# EasyEDA Pro project New Project_2022-11-25_16-02-02.eprj

# Schematic Schematic1
Create Date: 2022-11-25; Page Name: P1; Project Name: New Project_2022-11-25_16-02-02; Schematic Name: Schematic1; Update Date: 2022-11-25; Company: EasyEDA.com; Drawed: EasyEDA Pro; Page Size: A4; Part Number: JLCPCB-002; Reviewed: EasyEDA Pro; Version: V0.1
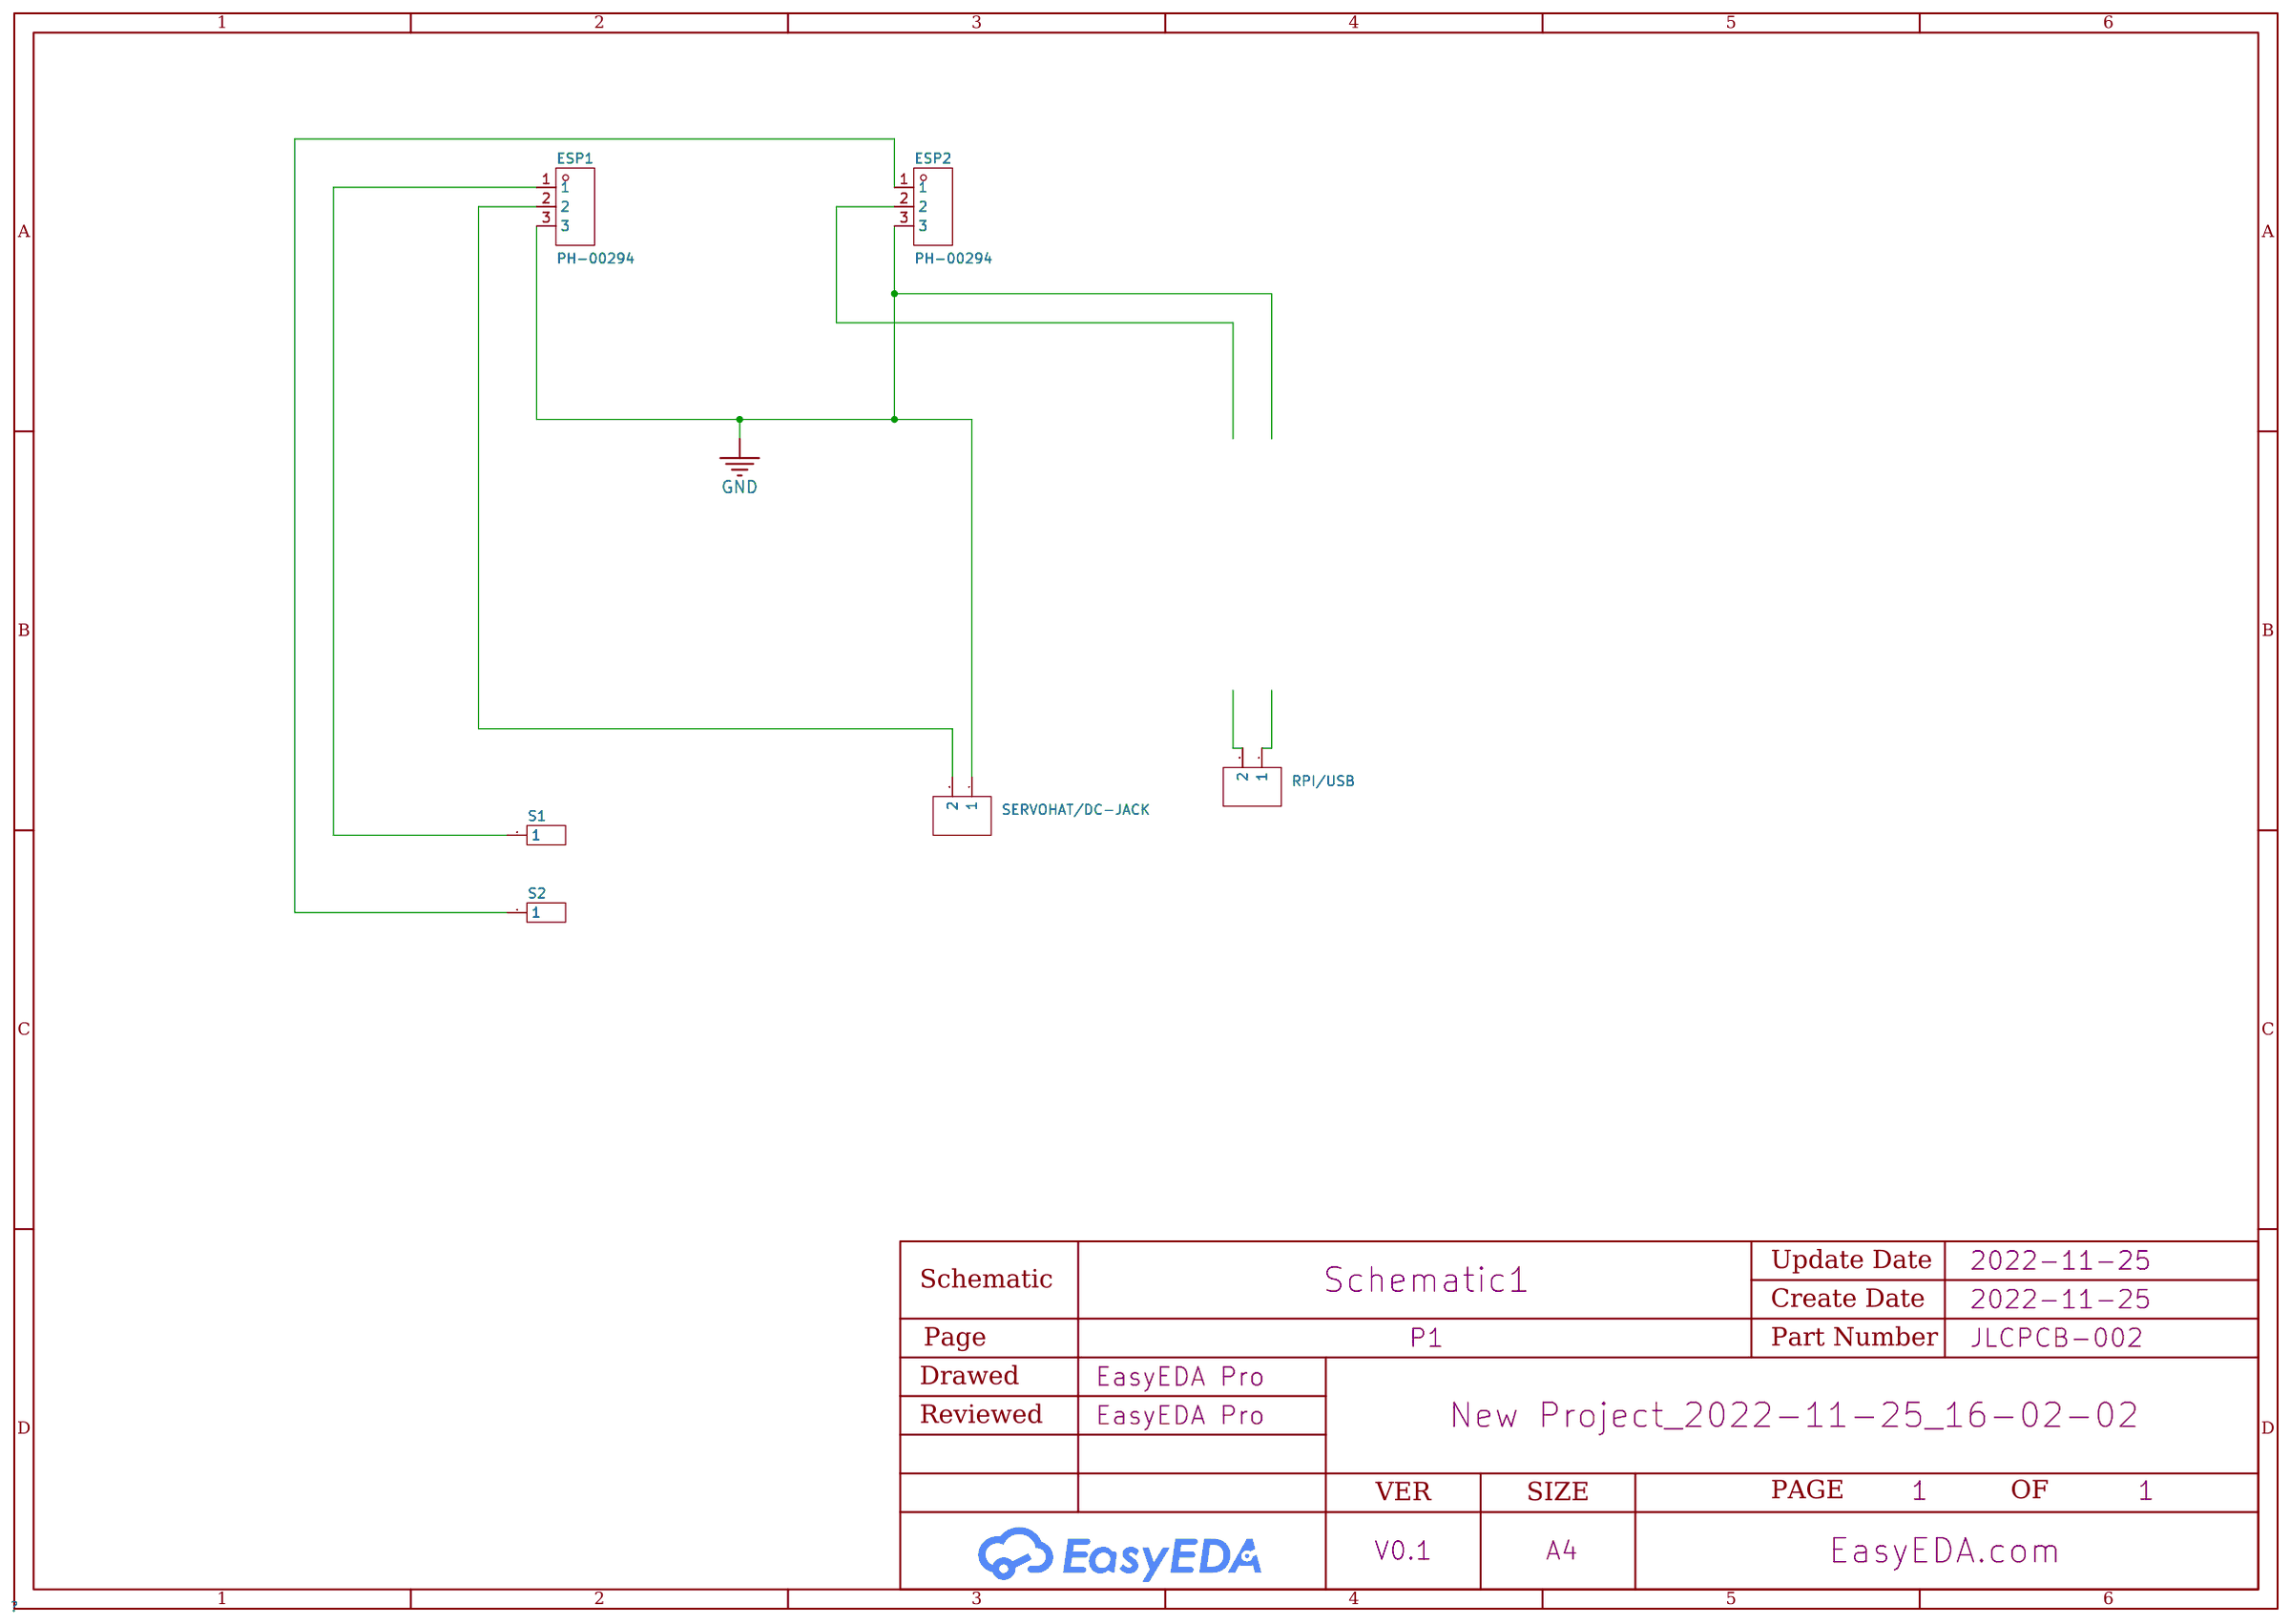
[diagram p0: schematic sheet]

## Parts
?#1  -
ESP1  PH-00294  [HDR-TH_3P-P2.54-V-M-B]
ESP2  PH-00294  [HDR-TH_3P-P2.54-V-M-B]
RPI/USB  -  [HDR-TH_2P-P2.54-V-F]
S1  -  [HDR-TH_1P-V-M_XKB_X4611WV-01I-C28D40]
S2  -  [HDR-TH_1P-V-M_XKB_X4611WV-01I-C28D40]
SERVOHAT/DC-JACK  -  [HDR-TH_2P-P2.54-V-F]

## Library data of the parts
ESP1 ESP2 = PH-00294: Pitch:2.54mm Number of Pins:3 Number of Rows: Pin Structure:1x3P Row Spacing:- Mounting Type:Straight Circluar Pins/Square Pins:Square Pins Current Rating (Max):3A Voltage Rating (Max):- Length of Mating Pin:3mm Insulation Height:- Length of End Connectio; LCSC Part Name: 2.54mm 1x3P 直插 方针; Supplier Part: C2829878; Manufacturer: Liansheng(连盛); Supplier Footprint: 直插,P=2.54mm; JLCPCB Part Class: Extended Part; Datasheet: https://atta.szlcsc.com/upload/public/pdf/source/20210507/C2829878_DC481C04FB41A0FEE0C13D51409916DB.pdf; Supplier: LCSC; Pitch: 2.54mm; Number of Pins: 3; Pin Structure: 1x3P; Mounting Type: Straight; Circluar Pins/Square Pins: Square Pins; Current Rating (Max): 3A; Length of Mating Pin: 3mm; Length of End Connection Pin: 3mm; Operating Temperature Range: -40~+105; Color: Black
RPI/USB SERVOHAT/DC-JACK = HDR-F_2.54_1x2P: Supplier Footprint: Through
S1 S2 = HDR-M_2.54_1x1P: Supplier Footprint: Through

## Nets
GND: ?#1.2 ESP1.3 ESP2.3 SERVOHAT/DC-JACK.1
Net-(?#1-1): ?#1.1 ESP2.2
Net-(?#1-3): ?#1.3 RPI/USB.2
Net-(?#1-4): ?#1.4 RPI/USB.1
Net-(ESP1-1): ESP1.1 S1.1
Net-(ESP1-2): ESP1.2 SERVOHAT/DC-JACK.2
Net-(ESP2-1): ESP2.1 S2.1

# Schematic XH-M401_8A
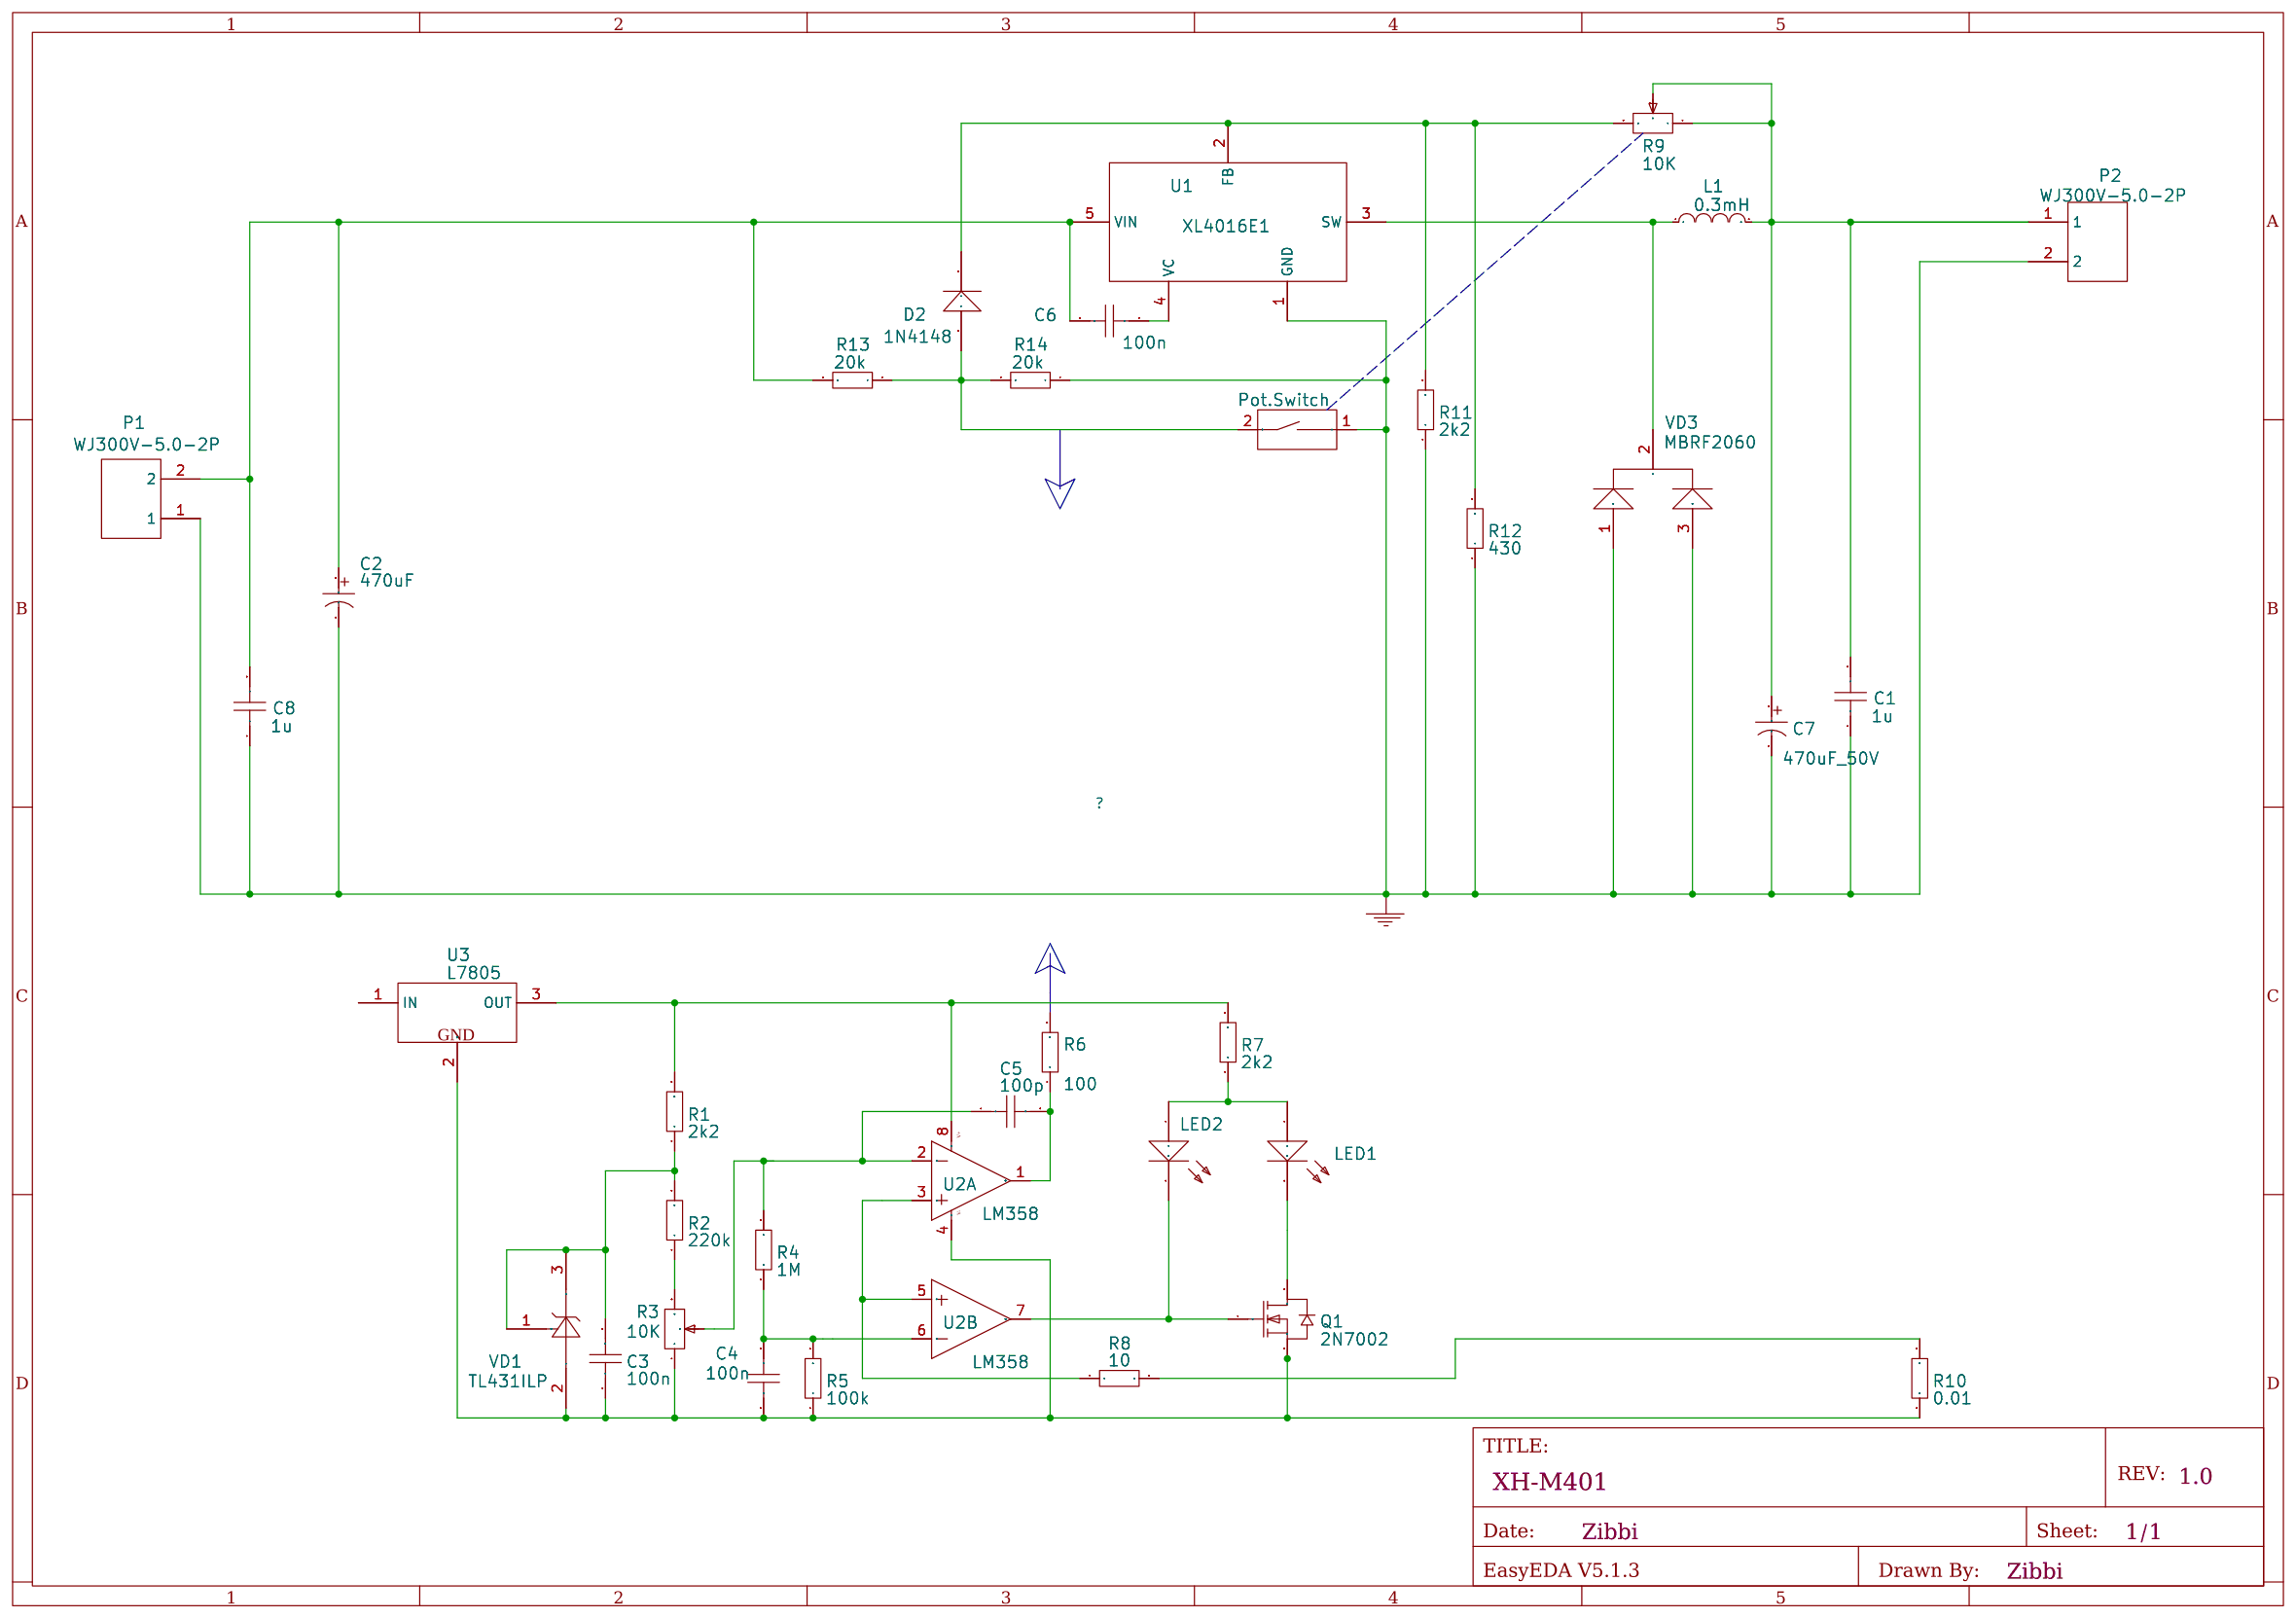
[diagram p1: schematic sheet]

## Parts
C1  1u
C2  470uF
C3  100n
C4  100n
C5  100p
C6  100n
C7  1000uF
C8  1u
D2  1N4148
L1  0.3mH
LED1  204-10UYC/S530-A3
LED2  204-10UYC/S530-A3
P1  WJ300V-5.0-2P
P2  WJ300V-5.0-2P
POT  Pot.Switch
Q1  2N7002
R1  2k2
R2  220k
R3  10KΩ
R4  1M
R5  100k
R6  100
R7  2k2
R8  10
R9  10KΩ
R10  0.18Ω
R11  2k2
R12  430
R13  20k
R14  20k
U1  XL4016E1
U2  LM358  (sections 1,2)
U3  L7805
VD1  TL431ILP
VD3  MBRF2060

## Library data of the parts
C1 C3-C6 C8 L1 R1 R2 R4-R8 R11-R14 U2 = ?
C2 = KF471M050G200A: Voltage: 50V; Supplier: LCSC; Manufacturer: CapXon; Supplier Part: C59355
C7 = KF102M050I250A: Voltage: 50V; Supplier: LCSC; Manufacturer: CapXon; Supplier Part: C59328
D2 = 1N4148: Supplier: LCSC; Manufacturer: ST; Supplier Part: C14516
LED1 LED2 = 204-10UYC/S530-A3: Supplier: LCSC; Manufacturer: EVERLIGHT; Supplier Part: C73643
P1 P2 = WJ300V-5.0-2P: Supplier: LCSC; Manufacturer: ReliaPro; image: //image.lceda.cn/szlcsc/C8385.jpg; Supplier Part: C8385
POT = VDG/S-01L blue: Supplier: LCSC; Manufacturer: ReliaPro; image: //image.lceda.cn/szlcsc/C47086.jpg; Supplier Part: C47086
Q1 = 2N7002: Supplier: LCSC; Manufacturer: CJ; Supplier Part: C8545
R3 R9 = 3362S-1-103LF: Supplier: LCSC; Manufacturer: BOURNS; Supplier Part: C81272
R10 = 25121WF180LT4F: Power: 1W; Tolerance: ±1%; Supplier: LCSC; Manufacturer: UniOhm; Supplier Part: C48628
U1 = XL4016E1: Supplier: LCSC; Manufacturer: XLSEMI; Supplier Part: C55881
U3 = L7805ABV: Supplier: LCSC; Manufacturer: STMicroelectronics; Supplier Part: C16807
VD1 = TL431ILP: Supplier: LCSC; Manufacturer: TI; Supplier Part: C113522
VD3 = ?: SWITCHMODE(TM) Schottky Power Rectifier, 3-Pin TO-220FP, Tube

## Nets
GND: C1.1 C2.2 C7.2 C8.1 P1.1 P2.2 POT.1 R11.1 R12.1 R14.1 U1.1(GND) VD3.1(A1) VD3.3(A2)
Net-(C1-2): C1.2 C7.1 L1.2 P2.1 R9.1 R9.2
Net-(C2-1): C2.1 C6.2 C8.2 P1.2 R13.2 U1.5(VIN)
Net-(C3-1): C3.1 C4.1 Q1.2(S) R3.1 R5.1 R10.1 U2.4(V-) U3.2(GND) VD1.2(A)
Net-(C3-2): C3.2 R1.1 R2.2 VD1.1(REF) VD1.3(C)
Net-(C4-2): C4.2 R4.1 R5.2 U2.6(-IN)
Net-(C5-1): C5.1 R3.2 R4.2 U2.2(-IN)
Net-(C5-2): C5.2 R6.1 U2.1(OUT)
Net-(C6-1): C6.1 U1.4(VC)
Net-(D2-1): D2.1(A) POT.2 R13.1 R14.2
Net-(D2-2): D2.2(K) R9.3 R11.2 R12.2 U1.2(FB)
Net-(L1-1): L1.1 U1.3(SW) VD3.2(K)
Net-(LED1-1): LED1.1(A) LED2.1(A) R7.1
Net-(LED1-2): LED1.2(C) Q1.3(D)
Net-(LED2-2): LED2.2(C) Q1.1(G) U2.7(OUT)
Net-(R1-2): R1.2 R7.2 U2.8(V+) U3.3(OUT)
Net-(R2-1): R2.1 R3.3
Net-(R8-1): R8.1 U2.3(+IN) U2.5(+IN)
Net-(R8-2): R8.2 R10.2

Not connected (* = marked no-connect by the designer): R6 2; U3 1(IN)
